# Altium schematic sheet MCU.SchDoc
size A4
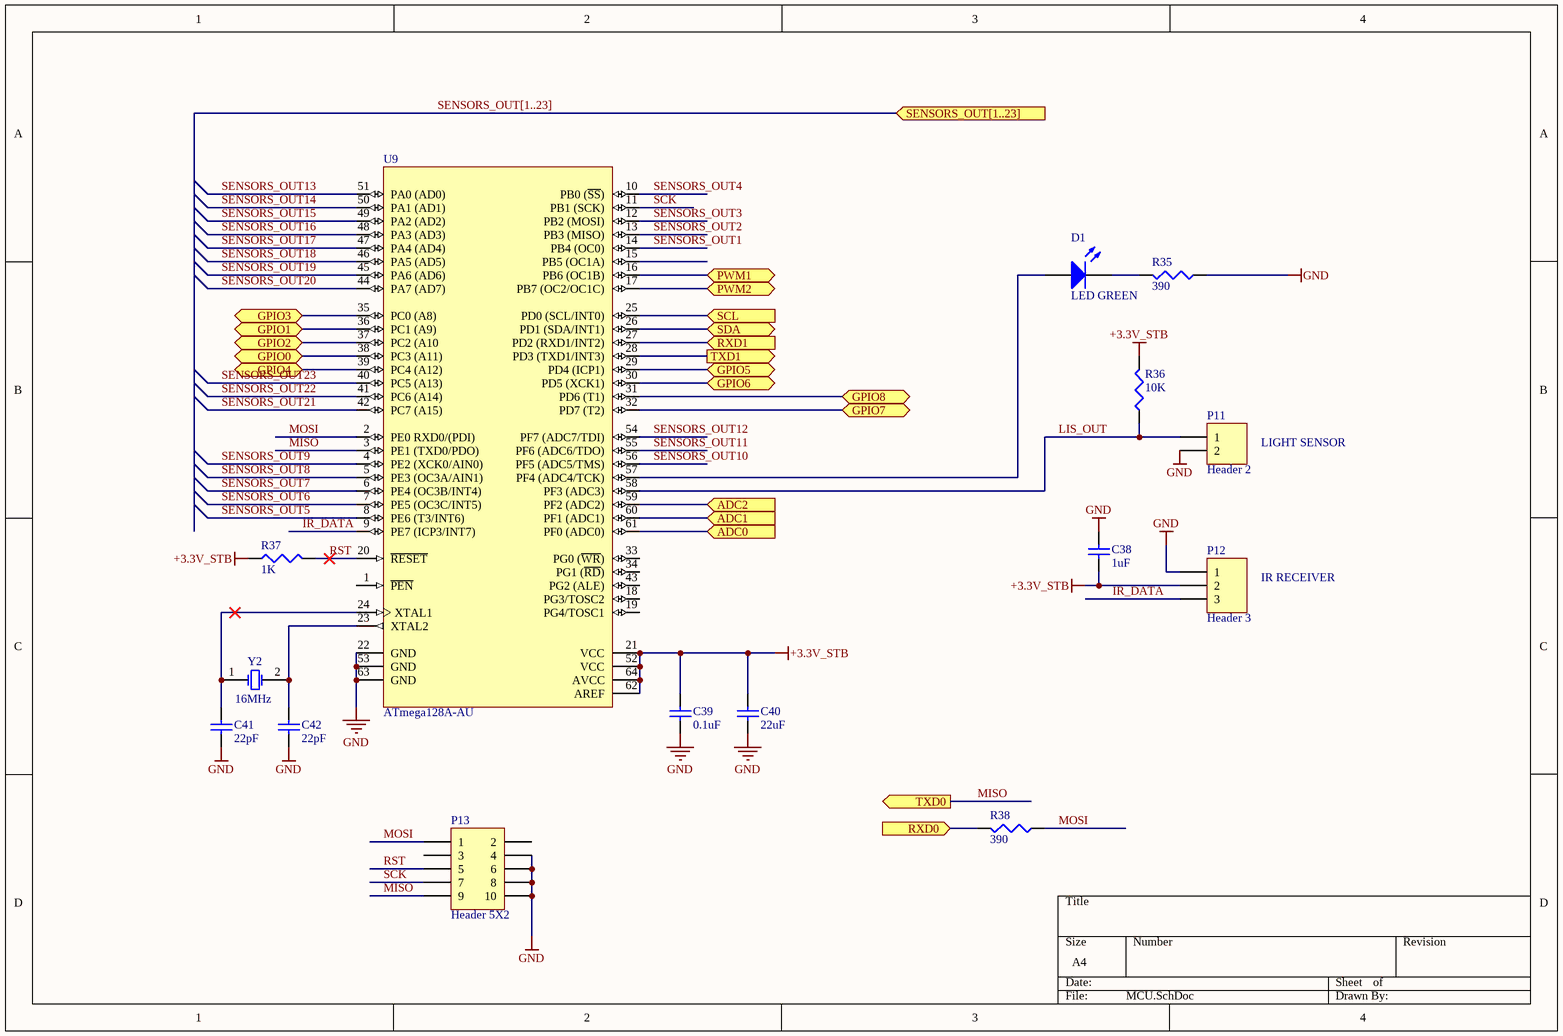
[diagram p0: MCU.SchDoc]

## Parts
C38  1uF  [1608[0603]]
C39  0.1uF  [2012[0805]]
C40  22uF  [2012[0805]]
C41  22pF  [2012[0805]]
C42  22pF  [2012[0805]]
D1  LED GREEN  [2012[0805]]
P11  Header 2  [HDR1X2]
P12  Header 3  [HDR1X3]
P13  Header 5X2  [HDR2X5]
R35  390  [R2012[0805]]
R36  10K  [R2012[0805]]
R37  1K  [R2012[0805]]
R38  390  [R2012[0805]]
U9  ATmega128A-AU  [64A_N]
Y2  16MHz  [HC49/4H_SMX]

## Ports
ADC0 (in), ADC1 (in), ADC2 (in), GPIO0 (bidir), GPIO1 (bidir), GPIO2 (bidir), GPIO3 (bidir), GPIO4 (bidir), GPIO5 (bidir), GPIO6 (bidir), GPIO7 (bidir), GPIO8 (bidir), PWM1 (bidir), PWM2 (bidir), RXD0 (in), RXD1 (in), SCL (in), SDA (bidir), SENSORS_OUT[1..23] (in), TXD0 (out), TXD1 (out)

## Nets
+3.3V_STB: C38.1 C39.2 C40.2 P12.2 R36.2 R37.1 U9.21(VCC) U9.52(VCC) U9.62(AREF) U9.64(AVCC)
GND: C38.2 C39.1 C40.1 C41.1 C42.1 P11.2 P12.1 P13.4 P13.6 P13.8 P13.10 R35.1 U9.22(GND) U9.53(GND) U9.63(GND)
ADC0: U9.61(PF0_(ADC0)) ; port ADC0
ADC1: U9.60(PF1_(ADC1)) ; port ADC1
ADC2: U9.59(PF2_(ADC2)) ; port ADC2
GPIO0: U9.38(PC3_(A11)) ; port GPIO0
GPIO1: U9.36(PC1_(A9)) ; port GPIO1
GPIO2: U9.37(PC2_(A10) ; port GPIO2
GPIO3: U9.35(PC0_(A8)) ; port GPIO3
GPIO4: U9.39(PC4_(A12)) ; port GPIO4
GPIO5: U9.29(PD4_(ICP1)) ; port GPIO5
GPIO6: U9.30(PD5_(XCK1)) ; port GPIO6
GPIO7: U9.32(PD7_(T2)) ; port GPIO7
GPIO8: U9.31(PD6_(T1)) ; port GPIO8
IR_DATA: P12.3 U9.9(PE7_(ICP3/INT7))
LIS_OUT: P11.1 R36.1 U9.58(PF3_(ADC3))
MISO: P13.9 U9.3(PE1_(TXD0/PDO)) ; port TXD0
MOSI: P13.1 R38.1 U9.2(PE0_RXD0/(PDI))
PWM1: U9.16(PB6_(OC1B)) ; port PWM1
PWM2: U9.17(PB7_(OC2/OC1C)) ; port PWM2
RST: P13.5 R37.2 U9.20(~{RESET})
RXD0: R38.2 ; port RXD0
RXD1: U9.27(PD2_(RXD1/INT2)) ; port RXD1
SCK: P13.7 U9.11(PB1_(SCK))
SCL: U9.25(PD0_(SCL/INT0)) ; port SCL
SDA: U9.26(PD1_(SDA/INT1)) ; port SDA
SENSORS_OUT1: U9.14(PB4_(OC0))
SENSORS_OUT2: U9.13(PB3_(MISO))
SENSORS_OUT3: U9.12(PB2_(MOSI))
SENSORS_OUT4: U9.10(PB0_(~{SS}))
SENSORS_OUT5: U9.8(PE6_(T3/INT6))
SENSORS_OUT6: U9.7(PE5_(OC3C/INT5))
SENSORS_OUT7: U9.6(PE4_(OC3B/INT4))
SENSORS_OUT8: U9.5(PE3_(OC3A/AIN1))
SENSORS_OUT9: U9.4(PE2_(XCK0/AIN0))
SENSORS_OUT10: U9.56(PF5_(ADC5/TMS))
SENSORS_OUT11: U9.55(PF6_(ADC6/TDO))
SENSORS_OUT12: U9.54(PF7_(ADC7/TDI))
SENSORS_OUT13: U9.51(PA0_(AD0))
SENSORS_OUT14: U9.50(PA1_(AD1))
SENSORS_OUT15: U9.49(PA2_(AD2))
SENSORS_OUT16: U9.48(PA3_(AD3))
SENSORS_OUT17: U9.47(PA4_(AD4))
SENSORS_OUT18: U9.46(PA5_(AD5))
SENSORS_OUT19: U9.45(PA6_(AD6))
SENSORS_OUT20: U9.44(PA7_(AD7))
SENSORS_OUT21: U9.42(PC7_(A15))
SENSORS_OUT22: U9.41(PC6_(A14))
SENSORS_OUT23: U9.40(PC5_(A13))
TXD1: U9.28(PD3_(TXD1/INT3)) ; port TXD1
NetC41_2: C41.2 U9.24(XTAL1) Y2.1(OSC1)
NetC42_2: C42.2 U9.23(XTAL2) Y2.2(OSC2)
NetD1_1: D1.1(A) U9.57(PF4_(ADC4/TCK))
NetD1_2: D1.2(K) R35.2

Not connected (* = marked no-connect by the designer): P13 2 3; U9 1(~{PEN}) 15(PB5_(OC1A)) 18(PG3/TOSC2) 19(PG4/TOSC1) 33(PG0_(~{WR})) 34(PG1_(~{RD})) 43(PG2_(ALE))

## Buses and harness runs
bus SENSORS_OUT[1..23] = port SENSORS_OUT[1..23]

## Notes on the sheet
- LIGHT SENSOR
- IR RECEIVER

## Library data of the parts
C38 = C0603: Ceramic Chip Capacitor - Standard; Note: Footprint corresponds to dimensions for bulk cassette packaging. This case size has tightened tolerances.; Published: 17-Jul-2002; LatestRevisionDate: 19-Mar-2004; LatestRevisionNote: Silkscreen size reduced.; DatasheetDocument: Mar-2001; PackageDocument: Mar-2001; PackageReference: 0603; Publisher: Altium Limited; Code_JEITA: 0603; Code_IPC: 1608 [0603]; ComponentLink1Description: Manufacturer Link; ComponentLink1URL: http://www.kemet.com/; ComponentLink2Description: Datasheet; ComponentLink2URL: http://www.kemet.com/kemet/web/homepage/kechome.nsf/vapubfilesname/F3102TA.pdf/$file/F3102TA.pdf; Value: 1uF
C39-C42 = C0805: Ceramic Chip Capacitor - Standard; Note: Footprint corresponds to dimensions for bulk cassette packaging. This case size has tightened tolerances.; Published: 17-Jul-2002; LatestRevisionDate: 19-Mar-2004; LatestRevisionNote: Silkscreen size reduced.; DatasheetDocument: Mar-2001; PackageDocument: Mar-2001; PackageReference: 0805; Publisher: Altium Limited; Code_JEITA: 0805; Code_IPC: 2012[0805]; ComponentLink1Description: Manufacturer Link; ComponentLink1URL: http://www.kemet.com/; ComponentLink2Description: Datasheet; ComponentLink2URL: http://www.kemet.com/kemet/web/homepage/kechome.nsf/vapubfilesname/F3102TA.pdf/$file/F3102TA.pdf
  C39: Value: 0.1uF
  C40: Value: 22uF
  C41 C42: Value: 22pF
D1 = LED0: Typical INFRARED GaAs LED; Published: 8-Jun-2000; LatestRevisionDate: 08-Jul-2005; LatestRevisionNote: Mech Layer 1 removed.; PackageReference: LED-0; Publisher: Altium Limited; PackageDescription: LED; 2 Leads
P11 = Header 2: Header, 2-Pin; LatestRevisionDate: 17-Jul-2002; LatestRevisionNote: Re-released for DXP Platform.; Publisher: Altium Limited
P12 = Header 3: Header, 3-Pin; LatestRevisionDate: 17-Jul-2002; LatestRevisionNote: Re-released for DXP Platform.; Publisher: Altium Limited
P13 = Header 5X2: Header, 5-Pin, Dual row; LatestRevisionDate: 17-Jul-2002; LatestRevisionNote: Re-released for DXP Platform.; Publisher: Altium Limited
R35-R38 = R0805: Published: 8-Jun-2000; LatestRevisionDate: 29-May-2009; LatestRevisionNote: IPC-7351 Footprint Added.; PackageReference: J1-0603; Publisher: Altium Limited; PackageDescription: Chip Resistor
  R35 R38: Value: 390
  R36: Value: 10K
  R37: Value: 1K
U9 = ATmega128A-AU: 8-bit AVR Microcontroller, 128KB Flash, 4KB EEPROM, 4KB SRAM, 64-pin TQFP, Industrial Grade (-40°C to 85°C); Published: 1-Apr-2010; DatasheetVersion: revE, Feb-2010; PackageVersion: revB, Oct-2001; PackageReference: 64A; Publisher: Altium Limited; PackageDescription: 64-Pin Plastic Thin Profile Quad Flat Pack, 14 x 14 x 1.0 mm Body, 0.8 mm Pitch (TQFP); Supplier 1: Digi-Key; Supplier Part Number 1: ATMEGA128A-AU-ND; Supplier 2: Farnell; Supplier Part Number 2: 1773397; Supplier 3: Mouser; Supplier Part Number 3: 556-ATMEGA128A-AU; Code_JEDEC: MS-026-AEB; ComponentLink1Description: Manufacturer Link; ComponentLink1URL: http://www.atmel.com/products/avr/default.asp?; ComponentLink2Description: ATmega128A Datasheet; ComponentLink2URL: http://www.atmel.com/dyn/resources/prod_documents/doc8151.pdf; ComponentLink3Description: ATmega128A Summary; ComponentLink3URL: http://www.atmel.com/dyn/resources/prod_documents/8151S.pdf; ComponentLink4Description: Atmel.com Home; ComponentLink4URL: http://www.atmel.com
Y2 = XTAL: Crystal Oscillator; Published: 8-Jun-2000; LatestRevisionDate: 17-Jul-2002; LatestRevisionNote: Re-released for DXP Platform.; PackageReference: R38; Publisher: Altium Limited; PackageDescription: Crystal, Thru-Hole; 2 Leads; Body 3.1 x 8.2 mm (Dia.xH); Value: 16MHz